# Altium schematic sheet 2016-02-21_13-02-55.schdoc
size 422 x 177 mm; SheetNumber: 1; SheetTotal: 1
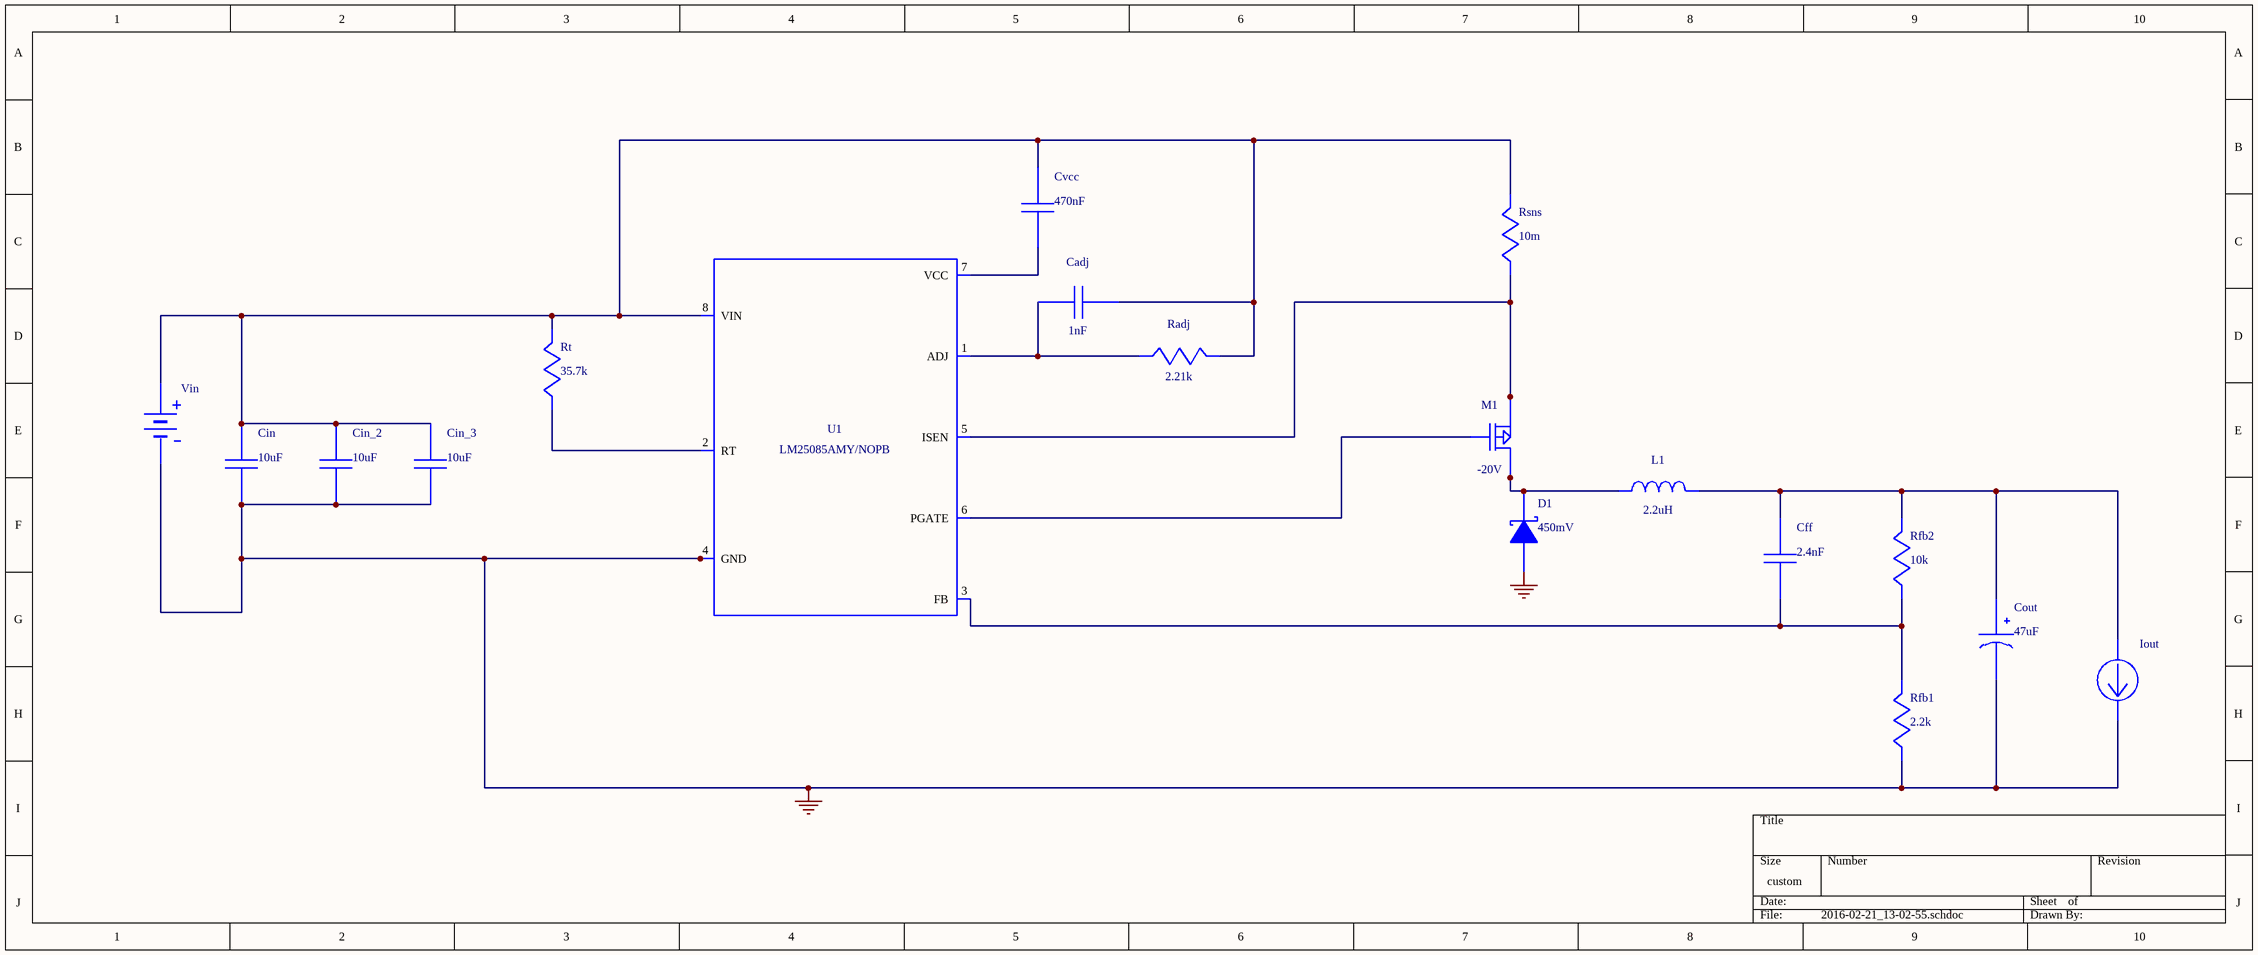
[diagram p0: 2016-02-21_13-02-55.schdoc]

## Parts
Cadj  value 1nF  (hidden comment: CL21C102JBCNFNC)
Cff  value 2.4nF  (hidden comment: GRM1885C1H242JA01D)
Cin  value 10uF  (hidden comment: GRM21BR61C106KE15L)
Cin_2  value 10uF  (hidden comment: GRM21BR61C106KE15L)
Cin_3  value 10uF  (hidden comment: GRM21BR61C106KE15L)
Cout  value 47uF  (hidden comment: 6TPU47MSI)
Cvcc  value 470nF  (hidden comment: 0805YC474KAT2A)
D1  value 450mV  (hidden comment: B340LA-13-F)
Iout  WB_CURRENT_LOAD  (value not drawn)
L1  value 2.2uH  (hidden comment: 74437368022)
M1  value -20V  (hidden comment: CSD25402Q3A)
Radj  value 2.21k  (hidden comment: CRCW04022K21FKED)
Rfb1  value 2.2k  (hidden comment: RC0603FR-072K2L)
Rfb2  value 10k  (hidden comment: CRCW040210K0FKED)
Rsns  value 10m  (hidden comment: CSR1206FK10L0)
Rt  value 35.7k  (hidden comment: CRCW040235K7FKED)
U1  LM5085MY/NOPB  (value not drawn)
Vin  WB_BATTERY  (value not drawn)

## Nets
0: Cin.2 Cin_2.2 Cin_3.2 Cout.2(-) D1.2(A) Iout.2(-) Rfb1.2 U1.4(GND) U1.9(EP) Vin.2(-)
NetCadj_1: Cadj.1 Cin.1 Cin_2.1 Cin_3.1 Cvcc.1 Radj.1 Rsns.1 Rt.1 U1.8(VIN) Vin.1(+)
NetCadj_2: Cadj.2 Radj.2 U1.1(ADJ)
NetCff_1: Cff.1 Cout.1(+) Iout.1(+) L1.2 Rfb2.1
NetCff_2: Cff.2 Rfb1.1 Rfb2.2 U1.3(FB)
NetCvcc_2: Cvcc.2 U1.7(VCC)
NetD1_1: D1.1(K) L1.1 M1.1(D) M1.2(D) M1.3(D)
NetM1_4: M1.4(G) U1.6(PGATE)
NetM1_5: M1.5(S) M1.6(S) M1.7(S) M1.8(S) M1.9(S) Rsns.2 U1.5(ISEN)
NetRt_2: Rt.2 U1.2(RT)

## Library data of the parts
Cadj = CL21C102JBCNFNC: Manufacturer Name: Samsung Electro-Mechanics; PackageReference: CL21C102JBCNFNC; Manufacturer Part Number: CL21C102JBCNFNC
Cff = GRM1885C1H242JA01D: GRM1885C1H242JA0; Manufacturer Name: MuRata; PackageReference: GRM1885C1H242JA01D; Manufacturer Part Number: GRM1885C1H242JA01D
Cin Cin_2 Cin_3 = GRM21BR61C106KE15L: GRM21BR61C106KE1; Manufacturer Name: MuRata; PackageReference: GRM21BR61C106KE15L; Manufacturer Part Number: GRM21BR61C106KE15L
Cout = 6TPU47MSI: Manufacturer Name: Panasonic; PackageReference: 6TPU47MSI; Manufacturer Part Number: 6TPU47MSI
Cvcc = 0805YC474KAT2A: Manufacturer Name: AVX; PackageReference: 0805YC474KAT2A; Manufacturer Part Number: 0805YC474KAT2A
D1 = B340LA-13-F: Manufacturer Name: Diodes Inc.; PackageReference: B340LA-13-F; Manufacturer Part Number: B340LA-13-F
Iout = WB_CURRENT_LOAD: Value: UNLISTED; PackageReference: WB_CURRENT_LOAD; Manufacturer Part Number: WB_CURRENT_LOAD; Manufacturer Name: WB_CURRENT_LOAD
L1 = 74437368022: Unknown; Manufacturer Name: Wurth Elektronik; PackageReference: 74437368022; Manufacturer Part Number: 74437368022
M1 = CSD25402Q3A: Manufacturer Name: Texas Instruments; PackageReference: CSD25402Q3A; Manufacturer Part Number: CSD25402Q3A
Radj = CRCW04022K21FKED: Manufacturer Name: Vishay-Dale; PackageReference: CRCW04022K21FKED; Manufacturer Part Number: CRCW04022K21FKED
Rfb1 = RC0603FR-072K2L: Manufacturer Name: Yageo America; PackageReference: RC0603FR-072K2L; Manufacturer Part Number: RC0603FR-072K2L
Rfb2 = CRCW040210K0FKED: Manufacturer Name: Vishay-Dale; PackageReference: CRCW040210K0FKED; Manufacturer Part Number: CRCW040210K0FKED
Rsns = CSR1206FK10L0: Manufacturer Name: Stackpole Electronics Inc; PackageReference: CSR1206FK10L0; Manufacturer Part Number: CSR1206FK10L0
Rt = CRCW040235K7FKED: Manufacturer Name: Vishay-Dale; PackageReference: CRCW040235K7FKED; Manufacturer Part Number: CRCW040235K7FKED
U1 = LM5085MY/NOPB: LM25085AMY/NOPB; Manufacturer Name: Texas Instruments; PackageReference: LM25085AMY/NOPB; Manufacturer Part Number: LM5085MY/NOPB; Value: Value
Vin = WB_BATTERY: Value: UNLISTED; PackageReference: WB_BATTERY; Manufacturer Part Number: WB_BATTERY; Manufacturer Name: WB_BATTERY